# Altium schematic sheet 滚动足球球蓝牙款.SchDoc
size A3
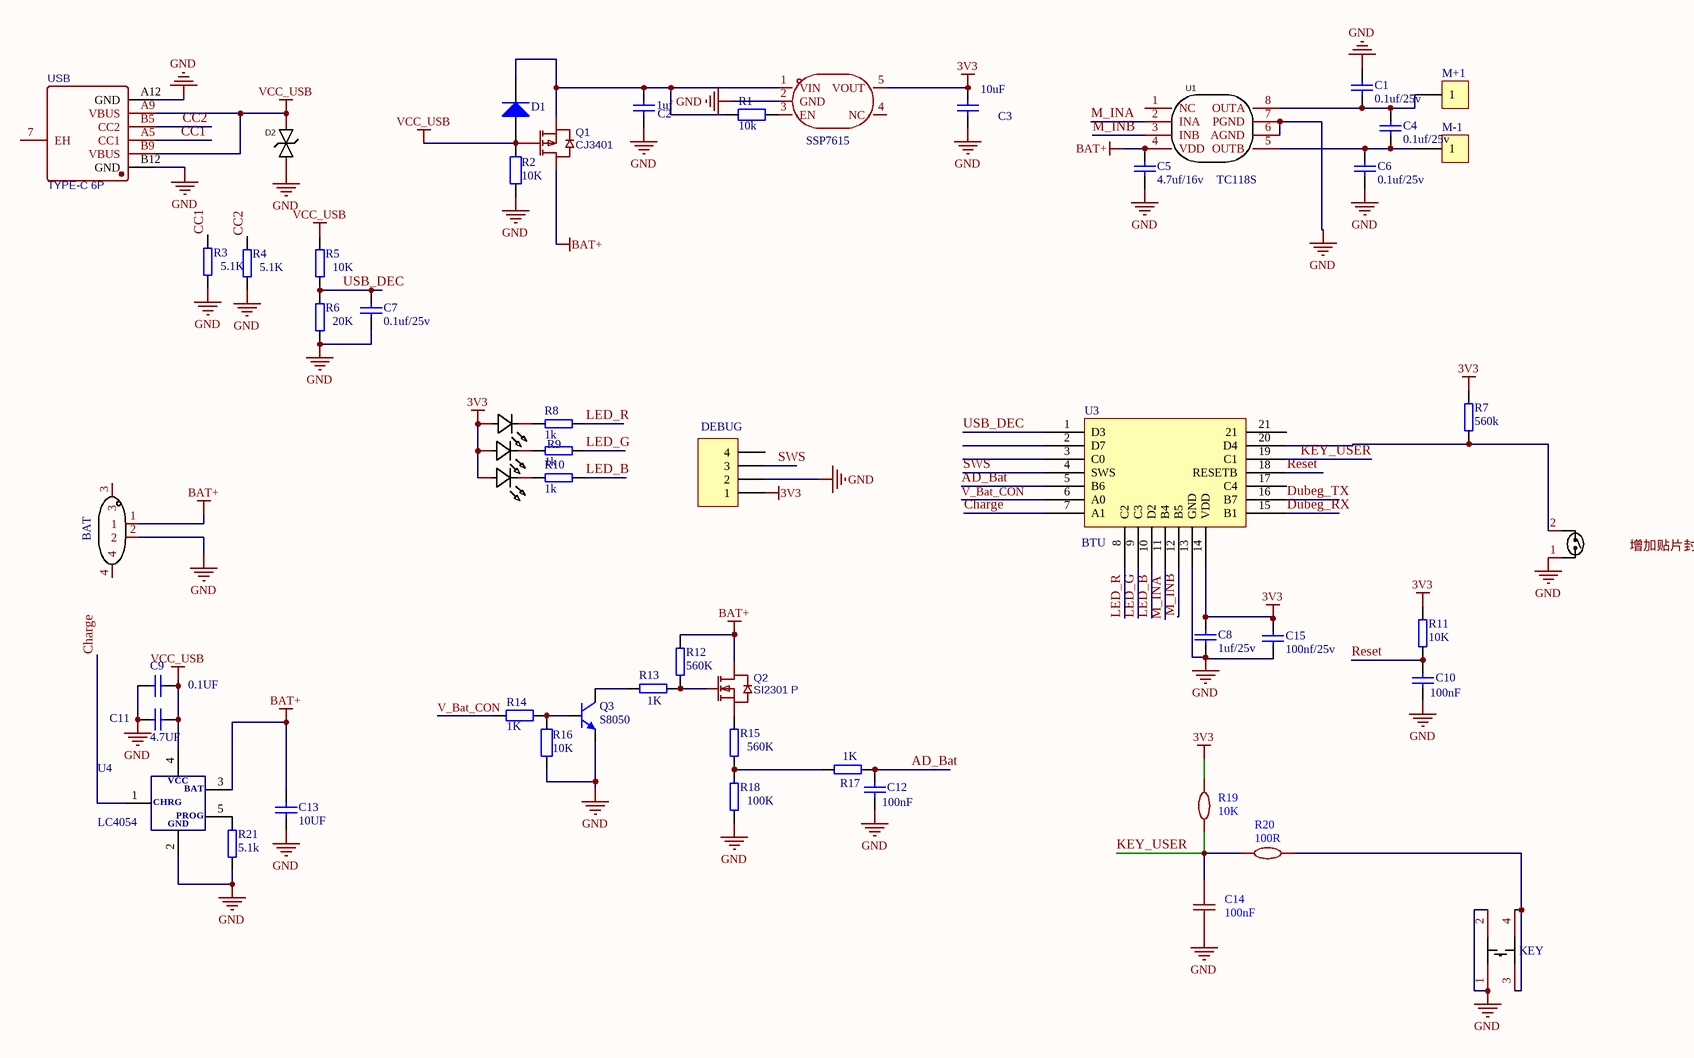
[diagram p0: 滚动足球球蓝牙款.SchDoc]

## Parts
C1  0.1uf/25v  [0603_C]
C2  1uf  [0603_C]
C3  10uF  [0603_C]
C4  0.1uf/25v  [0603_C]
C5  4.7uf/16v  [0805_C]
C6  0.1uf/25v  [0603_C]
C7  0.1uf/25v  [0603_C]
C8  1uf/25v  [0603_C]
C9  0.1UF  [0603_c]
C10  100nF  [0603_C]
C11  4.7UF  [0603_c]
C12  100nF  [0603_C]
C13  10UF  [0603_C]
C14  100nF  [0603_c]
C15  100nf/25v  [0603_C]
CN1  BAT  [CONN-SMD_1.25-2PWT]
D1  (no value)  [SOD-123FL]
D2  SMF5.0CA_C726939  [SOD-123 双向]  (value not drawn)
K1  KEY  [SW-SMD_4P-L4.5-W4.5-P3.00-LS7.0]
LED1  S6-3528RGBTA  [LED-SMD-6P_S6-3528RGBTA]  (value not drawn)
M+1  (no value)  [PAD2]
M-1  (no value)  [PAD2]
P1  DEBUG  [SIP4-2.54]
Q1  CJ3401  [SOT-23]
Q2  SI2301 P  [SOT-23]
Q3  S8050  [SOT-23(SOT-23-3)]
R1  10k  [0603_R]
R2  10K  [0603_R]
R3  5.1K  [0603_R]
R4  5.1K  [0603_R]
R5  10K  [0603_R]
R6  20K  [0603_R]
R7  560k  [0603_R]
R8  1k  [0603_R]
R9  1k  [0603_R]
R10  1k  [0603_R]
R11  10K  [0603_R]
R12  560K  [0603_R]
R13  1K  [0603_R]
R14  1K  [0603_r]
R15  560K  [0603_R]
R16  10K  [0603_r]
R17  1K  [0603_R]
R18  100K  [0603_R]
R19  10K  [0603_R]
R20  100R  [0603_R]
R21  5.1k  [0603_R]
SW1  SW-18010P  [SMD-X160]  (value not drawn)
U1  TC118S  [SOP8]
U2  SSP7615  [SOT-23-5]
U3  BTU  [BTU]
U4  LC4054  [SOT-23-5]
USB  TYPE-C 6P  [TPYE-C-6]

## Nets
3V3: C3.2 C8.2 C15.2 LED1.4 LED1.5 LED1.6 P1.1 R7.2 R11.1 R19.2 U2.5(VOUT) U3.14(VDD)
BAT+: C5.1 C13.2 CN1.1 Q1.3(D) Q2.2(D) R12.1 U1.4(VDD) U4.3
GND: C1.2 C2.1 C3.1 C5.2 C6.1 C7.1 C8.1 C9.1 C10.1 C11.1 C12.1 C13.1 C14.1 C15.1 CN1.2 D2.1 K1.1 K1.2 P1.2 Q3.2(E) R2.1 R3.2 R4.2 R6.2 R16.1 R18.2 R21.1 SW1.1 U1.6(AGND) U1.7(PGND) U2.2(GND) U3.13(GND) U4.2 USB.A12(GND) USB.B12(GND)
VCC_USB: C9.2 C11.2 D1.1(A) D2.2 Q1.1(G) R2.2 R5.1 U4.4 USB.A9(VBUS) USB.B9(VBUS)
AD_Bat: C12.2 R17.1 U3.5(B6)
CC1: R3.1 USB.A5(CC1)
CC2: R4.1 USB.B5(CC2)
Charge: U3.7(A1) U4.1
Dubeg_RX: U3.15(B1)
Dubeg_TX: U3.16(B7)
KEY_USER: C14.2 R19.1 R20.2 U3.19(C1)
LED_B: R10.2 U3.10(D2)
LED_G: R9.2 U3.9(C3)
LED_R: R8.2 U3.8(C2)
M_INA: U1.2(INA) U3.11(B4)
M_INB: U1.3(INB) U3.12(B5)
Reset: C10.2 R11.2 U3.18(RESETB)
SWS: P1.3 U3.4(SWS)
USB_DEC: C7.2 R5.2 R6.1 U3.1(D3)
V_Bat_CON: R14.2 U3.6(A0)
NetC1_1: C1.1 C4.2 M+1.1 U1.8(OUTA)
NetC2_2: C2.2 D1.2(K) Q1.2(S) R1.1 U2.1(VIN)
NetC4_1: C4.1 C6.2 M-1.1 U1.5(OUTB)
NetK1_3: K1.3 K1.4 R20.1
NetLED1_1: LED1.1 R10.1
NetLED1_2: LED1.2 R9.1
NetLED1_3: LED1.3 R8.1
NetQ2_1: Q2.1(G) R12.2 R13.1
NetQ2_3: Q2.3(S) R15.1
NetQ3_1: Q3.1(B) R14.1 R16.2
NetQ3_3: Q3.3(C) R13.2
NetR1_2: R1.2 U2.3(EN)
NetR7_1: R7.1 SW1.2 U3.20(D4)
NetR15_2: R15.2 R17.2 R18.1
NetR21_2: R21.2 U4.5

Not connected (* = marked no-connect by the designer): CN1 3 4; P1 4; U1 1(NC); U2 4(NC); U3 2(D7) 3(C0) 17(C4) 21; USB 7(EH)

## Notes on the sheet
- Labels drawn without touching a wire or pin: 增加贴片封装
- (in symbol LTC4054) VCC; BAT; CHRG; PROG; GND

## Library data of the parts
C1 C3-C8 C15 = Cap: Capacitor; Value: 10nF; Published: 8-Jun-2000; Revision: July-2002: Re-released for DXP Platform.; Publisher: Altium Limited
C2 = Cap1: 无极电容
C9-C13 = CAP
C14 = CAP_0603: Symbol: CapAcitance; Convert to PCB: yes; Device: CAP_0603; Add into BOM: yes; Supplier Footprint: 0603; Value: 100nF
CN1 = HC-1.25-2PLT: Add into BOM: yes; Pins Structure: 1x2P; Pitch: 1.25mm; Number of PINs Per Row: 2; Current Rating (Max): 2A; Symbol: HC-1.25-2PLT; Device: HC-1.25-2PLT; Supplier Part: C2845388; Manufacturer Part: HC-1.25-2PLT; Supplier Footprint: SMD,P=1.25mm; JLCPCB Part Class: Extended Part; Datasheet: https://atta.szlcsc.com/upload/public/pdf/source/20230707/8E5913B5A3195C18F5EE12EA4CB86B82.pdf; Supplier: LCSC; Convert to PCB: yes; Reference Series: -; Number of Pins: 2P; Number of Rows: 1; Row Spacing: -
D1 = Diode 1N4148: High Conductance Fast Diode; Published: 8-Jun-2000; LatestRevisionDate: 17-Jul-2002; LatestRevisionNote: Re-released for DXP Platform.; DatasheetVersion: 1997; PackageReference: DO-35; Publisher: Altium Limited; PackageDescription: Diode, Axial; Body 3.8 x 1.9 mm (LxDia. max), Lead Dia. 0.53 mm (max); Code_JEDEC: DO-204-AH; ComponentLink1Description: Manufacturer Link; ComponentLink1URL: http://www.fairchildsemi.com/; ComponentLink2Description: Datasheet; ComponentLink2URL: http://www.fairchildsemi.com/ds/1N%2F1N4148.pdf
D2 = SMF5.0CA_C726939: Add into BOM: yes; Symbol: SMF5.0CA_C726939; Device: SMF5.0CA_C726939; Supplier: LCSC; Supplier Part: C726939; Manufacturer Part: SMF5.0CA; JLCPCB Part Class: Extended Part; LCSC Part Name: SMF5.0CA; Supplier Footprint: SOD-123FL; Datasheet: https://atta.szlcsc.com/upload/public/pdf/source/20200825/C726891_B615A55314C94A3B16B7FBCD32D40567.pdf; Convert to PCB: yes
K1 = TS-1002S-05026C: Add into BOM: yes; Switch Length: 6mm; Switch Height: 5mm; Contact Current: 50mA; Voltage Rating (DC): 12V; Symbol: TS-1002S-05026C; Device: TS-1002S-05026C; Supplier: LCSC; Supplier Part: C455110; Manufacturer Part: TS-1002S-05026C; JLCPCB Part Class: Extended Part; Supplier Footprint: SMD,6x6mm; Datasheet: https://atta.szlcsc.com/upload/public/pdf/source/20191118/C455126_F61E8FA1ED640FB1CE0B30B55DEB62E3.pdf; Convert to PCB: yes; Switch Width: 6mm; With Lamp: -; Mechanical Life: -
LED1 = S6-3528RGBTA: Add into BOM: yes; Name: S6-3528RGBTA; Symbol: S6-3528RGBTA; Device: S6-3528RGBTA; Supplier Part: C2843672; Manufacturer Part: S6-3528RGBTA; Supplier Footprint: SMD3528; JLCPCB Part Class: Extended Part; Datasheet: https://atta.szlcsc.com/upload/public/pdf/source/20210906/570F82B9B24ACE538FD2728DBBE6FA45.pdf; Supplier: LCSC; Convert to PCB: yes
M+1 M-1 = CON1
P1 = Header 4: Header, 4-Pin; LatestRevisionDate: 17-Jul-2002; LatestRevisionNote: Re-released for DXP Platform.; Publisher: Altium Limited
Q1 = CJ3401: BOM_Manufacturer: CJ; BOM_Supplier: LCSC; BOM_Manufacturer Part: CJ3401; BOM_Supplier Part: C13799; BOM_JLCPCB Part Class: Extended Part; spicePre: Q; spiceSymbolName: CJ3401
Q2 = JMTL3400A: Contributor: LCSC; BOM_Supplier: LCSC; BOM_Supplier Part: C2890442; BOM_Manufacturer Part: JMTL3400A; BOM_JLCPCB Part Class: Extended Part; spicePre: Q; spiceSymbolName: JMTL3400A
Q3 = NPN_sot23: NPN三极管
R1 R2 R14 R16 = Res2: Resistor; Value: 120R; Published: 8-Jun-2000; LatestRevisionDate: 17-Jul-2002; LatestRevisionNote: Re-released for DXP Platform.; PackageReference: AXIAL-0.4; Publisher: Altium Limited
R3-R13 R15 R17 R18 R21 = RES
R19 R20 = Res_0603: Convert to PCB: yes; Device: Res_0603; Add into BOM: yes; Supplier Footprint: 0603
  R19: Value: 10K
  R20: Value: 100R
SW1 = SW-18010P: Add into BOM: yes; Rated Voltage: 12V; Rated Current: 20mA; Name: SW-18010P; Symbol: SW-18010P; Device: SW-18010P; Supplier Part: C2681585; Manufacturer Part: SW-18010P; JLCPCB Part Class: Extended Part; Datasheet: https://atta.szlcsc.com/upload/public/pdf/source/20210122/C2681585_58E357A0608CE0F21BF5D2CFA19487E4.pdf; Supplier: LCSC; Convert to PCB: yes; Sensor Type: -; Temperature Resistance: -
U1 = TC118S: Add into BOM: yes; Name: TC118S; Symbol: TC118S; Device: TC118S; LCSC Part Name: TC118S; Supplier Part: C88308; Manufacturer Part: TC118S; Supplier Footprint: SOP-8_150mil; JLCPCB Part Class: Extended Part; Datasheet: https://atta.szlcsc.com/upload/public/pdf/source/20161129/1480413782462.pdf; Supplier: LCSC; Convert to PCB: yes
U2 = SSP7615-33M5R: Symbol: SSP7615-33M5R
U4 = LTC4054
USB = TYPE-C 6P: BOM_Manufacturer: SHOU HAN; Contributor: LCSC; BOM_Supplier: LCSC; BOM_Supplier Part: C456012; BOM_Manufacturer Part: TYPE-C 6P; BOM_JLCPCB Part Class: Extended Part; spicePre: U; spiceSymbolName: TYPE-C 6P